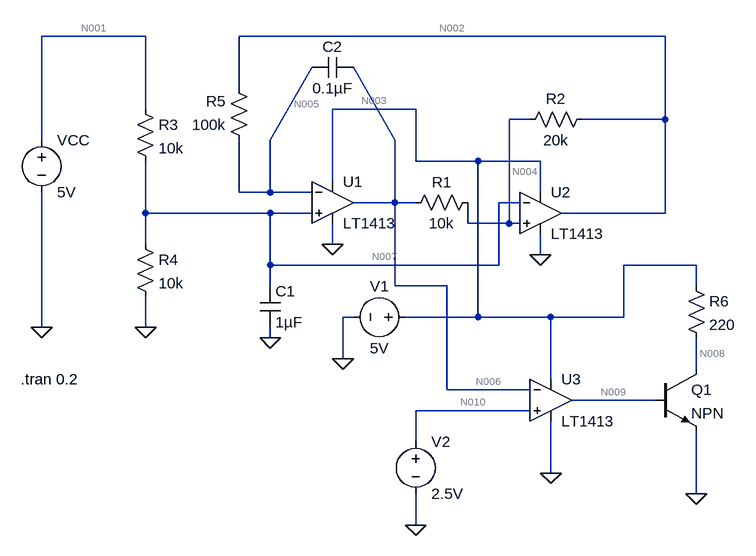
[diagram p0: schematic control_servo.asc]
control_servo.asc, the LTspice schematic file:
Version 4.1
SHEET 1 920 680
WIRE -1472 -1344 -1632 -1344
WIRE -672 -1344 -1328 -1344
WIRE -1328 -1264 -1328 -1344
WIRE -1472 -1232 -1472 -1344
WIRE -1056 -1232 -1184 -1232
WIRE -880 -1216 -912 -1216
WIRE -672 -1216 -672 -1344
WIRE -672 -1216 -800 -1216
WIRE -1632 -1184 -1632 -1344
WIRE -1280 -1184 -1216 -1296
WIRE -1088 -1184 -1152 -1296
WIRE -1056 -1152 -1056 -1232
WIRE -960 -1152 -1056 -1152
WIRE -864 -1152 -960 -1152
WIRE -1184 -1120 -1184 -1232
WIRE -1328 -1104 -1328 -1184
WIRE -1280 -1104 -1280 -1184
WIRE -1280 -1104 -1328 -1104
WIRE -1216 -1104 -1280 -1104
WIRE -864 -1104 -864 -1152
WIRE -1088 -1088 -1088 -1184
WIRE -1088 -1088 -1152 -1088
WIRE -1056 -1088 -1088 -1088
WIRE -896 -1088 -928 -1088
WIRE -1472 -1072 -1472 -1152
WIRE -1280 -1072 -1472 -1072
WIRE -1216 -1072 -1280 -1072
WIRE -672 -1072 -672 -1216
WIRE -672 -1072 -832 -1072
WIRE -976 -1056 -976 -1088
WIRE -912 -1056 -912 -1216
WIRE -912 -1056 -976 -1056
WIRE -896 -1056 -912 -1056
WIRE -1472 -1024 -1472 -1072
WIRE -1184 -1024 -1184 -1056
WIRE -864 -1008 -864 -1040
WIRE -1280 -992 -1280 -1072
WIRE -928 -992 -928 -1088
WIRE -928 -992 -1280 -992
WIRE -624 -992 -736 -992
WIRE -1280 -960 -1280 -992
WIRE -1088 -960 -1088 -1088
WIRE -1008 -960 -1088 -960
WIRE -624 -960 -624 -992
WIRE -1152 -912 -1168 -912
WIRE -960 -912 -960 -1152
WIRE -960 -912 -1072 -912
WIRE -848 -912 -960 -912
WIRE -736 -912 -736 -992
WIRE -736 -912 -848 -912
WIRE -1632 -896 -1632 -1104
WIRE -1472 -896 -1472 -944
WIRE -1280 -880 -1280 -896
WIRE -1168 -848 -1168 -912
WIRE -624 -832 -624 -880
WIRE -848 -816 -848 -912
WIRE -1008 -800 -1008 -960
WIRE -880 -800 -1008 -800
WIRE -688 -784 -816 -784
WIRE -880 -768 -1056 -768
WIRE -1056 -720 -1056 -768
WIRE -848 -672 -848 -752
WIRE -624 -640 -624 -736
WIRE -1056 -592 -1056 -640
FLAG -1280 -880 0
FLAG -1472 -896 0
FLAG -1632 -896 0
FLAG -1184 -1024 0
FLAG -864 -1008 0
FLAG -1168 -848 0
FLAG -848 -672 0
FLAG -1056 -592 0
FLAG -624 -640 0
DATAFLAG -624 -864 ""
DATAFLAG -624 -864 ""
DATAFLAG -624 -864 ""
SYMBOL res -960 -1104 R90
WINDOW 0 0 56 VBottom 2
WINDOW 3 32 56 VTop 2
SYMATTR InstName R1
SYMATTR Value 10k
SYMBOL res -784 -1232 R90
WINDOW 0 0 56 VBottom 2
WINDOW 3 32 56 VTop 2
SYMATTR InstName R2
SYMATTR Value 20k
SYMBOL cap -1296 -960 R0
SYMATTR InstName C1
SYMATTR Value 1µF
SYMBOL res -1488 -1248 R0
SYMATTR InstName R3
SYMATTR Value 10k
SYMBOL res -1488 -1040 R0
SYMATTR InstName R4
SYMATTR Value 10k
SYMBOL res -1312 -1168 R180
WINDOW 0 36 76 Left 2
WINDOW 3 36 40 Left 2
SYMATTR InstName R5
SYMATTR Value 100k
SYMBOL cap -1152 -1312 R90
WINDOW 0 0 32 VBottom 2
WINDOW 3 32 32 VTop 2
SYMATTR InstName C2
SYMATTR Value 0.1µF
SYMBOL voltage -1632 -1200 R0
SYMATTR InstName VCC
SYMATTR Value 5V
SYMBOL OpAmps\\LT1413 -864 -1136 R0
SYMATTR InstName U2
SYMBOL OpAmps\\LT1413 -1184 -1152 R0
SYMATTR InstName U1
SYMBOL voltage -1056 -912 R90
WINDOW 0 -32 56 VBottom 2
WINDOW 3 32 56 VTop 2
SYMATTR InstName V1
SYMATTR Value 5V
SYMBOL OpAmps\\LT1413 -848 -848 R0
SYMATTR InstName U3
SYMBOL voltage -1056 -736 R0
SYMATTR InstName V2
SYMATTR Value 2.5V
SYMBOL npn -688 -832 R0
SYMATTR InstName Q1
SYMBOL res -640 -976 R0
SYMATTR InstName R6
SYMATTR Value 220
TEXT -1664 -816 Left 2 !.tran 0.2

The netlist it stands for:
* control_servo.asc
R1 N004 N006 10k
R2 N002 N004 20k
C1 N007 0 1µF
R3 N001 N007 10k
R4 N007 0 10k
R5 N005 N002 100k
C2 N006 N005 0.1µF
VCC N001 0 5V
X§U2 N004 N007 N003 0 N002 LT1413  ; pins In+ In- V+ V- OUT
X§U1 N007 N005 N003 0 N006 LT1413  ; pins In+ In- V+ V- OUT
V1 N003 0 5V
X§U3 N010 N006 N003 0 N009 LT1413  ; pins In+ In- V+ V- OUT
V2 N010 0 2.5V
Q1 N008 N009 0 0 NPN
R6 N003 N008 220
.model NPN NPN
.model PNP PNP
.lib standard.bjt
.tran 0.2
.lib LTC.lib
.backanno
.end

* Results of the author's LTspice run, read from the files saved beside the schematic
* Operating Point, zero values left out:
*   V(n006) = 2.501 V
*   V(n007) = 2.5 V
*   V(n001) = 5 V
*   V(n003) = 5 V
*   V(n008) = 5 V
*   V(n004) = 2.5 V
*   V(n002) = 2.499 V
*   V(n005) = 2.5 V
*   V(n010) = 2.5 V
*   V(n009) = 108.1 mV
*   I(R4) = 250 µA
*   I(R5) = 12 nA
*   I(VCC) = -250 µA
*   I(V1) = -1.05 mA
*   Ic(Q1) = 4.899 pA
*   Ib(Q1) = -4.784 pA
*   I(R6) = 4.899 pA
*   I(R1) = -48.01 nA
*   I(R2) = -60.01 nA
*   I(R3) = 250 µA
*   I(V2) = 12 nA
*   Ix(u1:1) = -12 nA
*   Ix(u1:2) = -12 nA
*   Ix(u1:3) = 350 µA
*   Ix(u1:4) = -350 µA
*   Ix(u1:5) = -36.01 nA
*   Ix(u2:1) = -12 nA
*   Ix(u2:2) = -12 nA
*   Ix(u2:3) = 350 µA
*   Ix(u2:4) = -350 µA
*   Ix(u2:5) = 72.01 nA
*   Ix(u3:1) = -12 nA
*   Ix(u3:2) = -12 nA
*   Ix(u3:3) = 350 µA
*   Ix(u3:4) = -350 µA
*   Ix(u3:5) = 9.568 pA
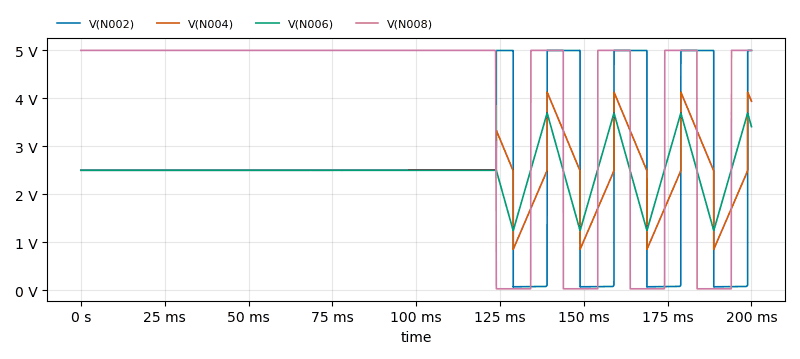
[diagram p1: Transient Analysis of control_servo.asc, plotted from the saved traces]
* Transient Analysis, 1 run:
*   V(N002): min 62.6 mV, max 5 V, average 2.453 V, rms 2.884 V, last 4.999 V
*   V(N004): min 848.2 mV, max 4.127 V, average 2.47 V, rms 2.537 V, last 3.94 V
*   V(N006): min 1.239 V, max 3.693 V, average 2.479 V, rms 2.518 V, last 3.41 V
*   V(N008): min 26.97 mV, max 5 V, average 3.974 V, rms 4.454 V, last 5 V